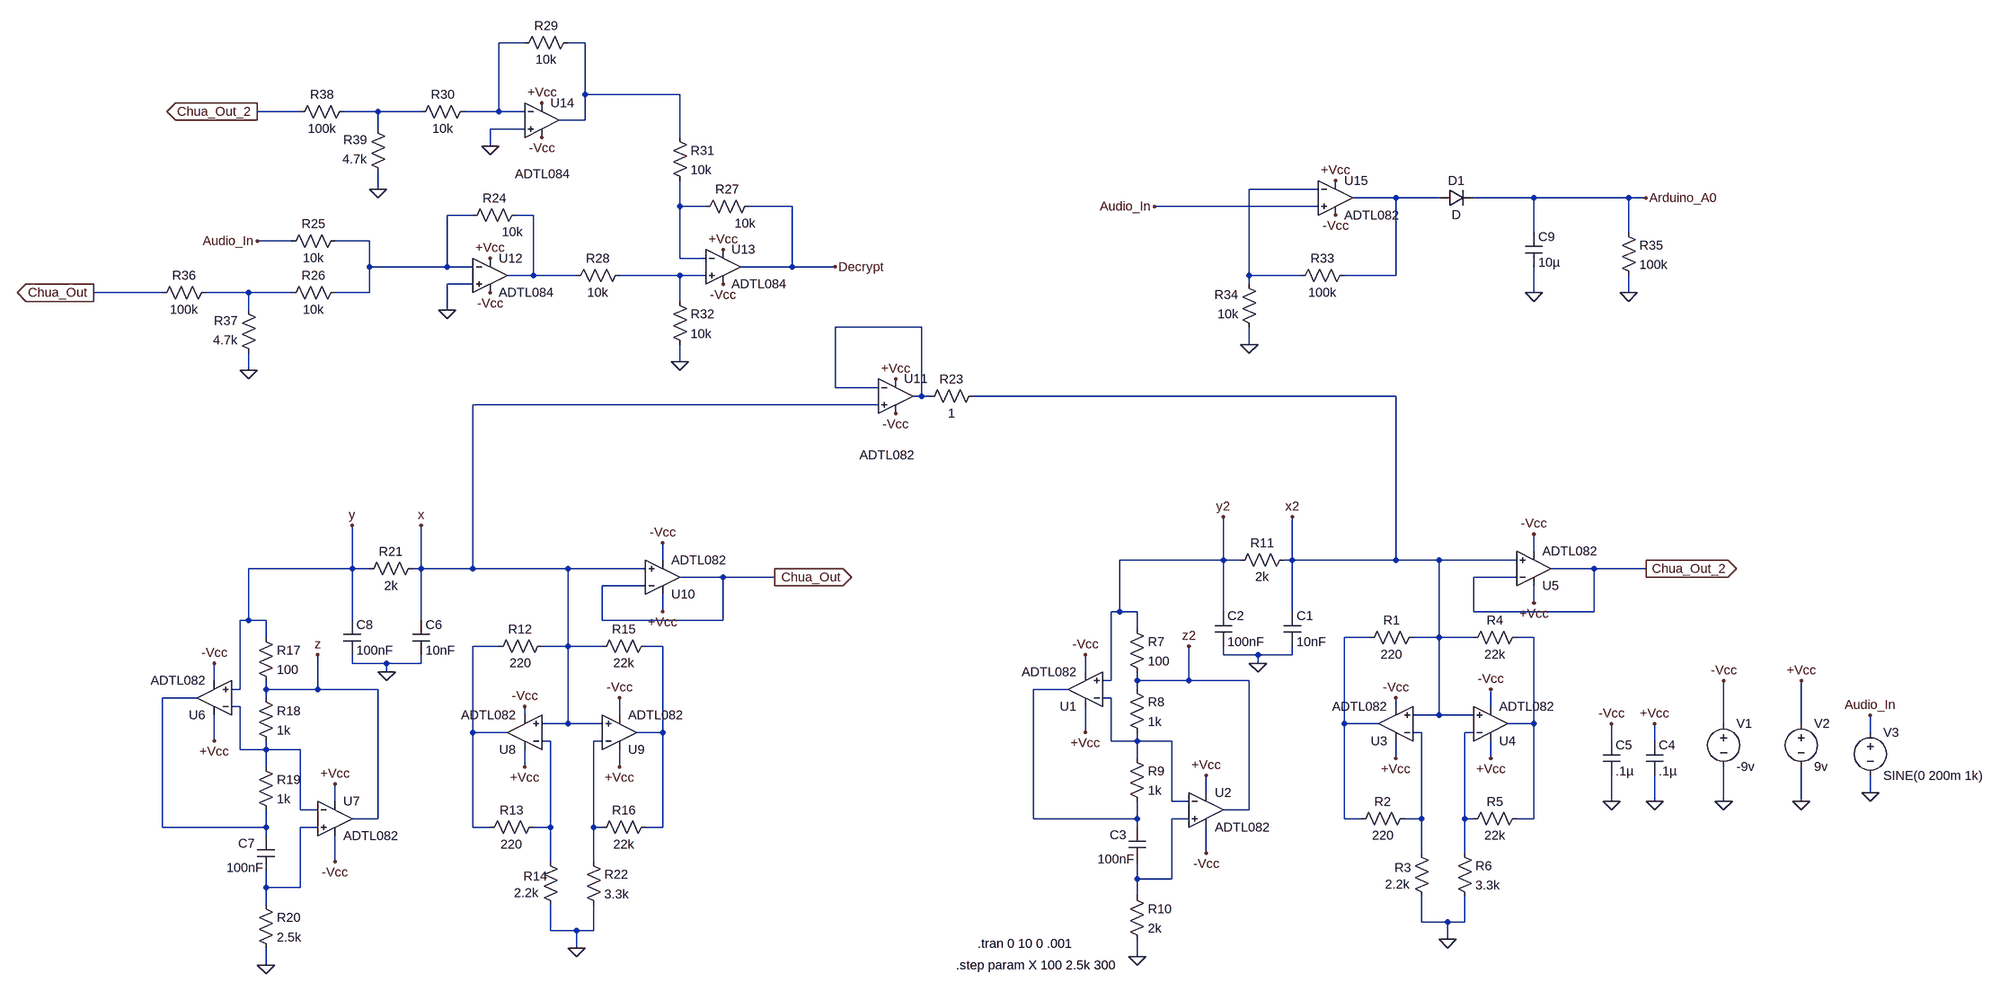
[diagram p0: schematic Chua - Copy.asc]
Chua - Copy.asc, the LTspice schematic file:
Version 4.1
SHEET 1 1768 708
WIRE -1024 -1168 -1072 -1168
WIRE -912 -1168 -944 -1168
WIRE -912 -1072 -912 -1168
WIRE -736 -1072 -912 -1072
WIRE -1440 -1040 -1520 -1040
WIRE -1296 -1040 -1360 -1040
WIRE -1216 -1040 -1296 -1040
WIRE -1072 -1040 -1072 -1168
WIRE -1072 -1040 -1136 -1040
WIRE -1024 -1040 -1072 -1040
WIRE -912 -1024 -912 -1072
WIRE -912 -1024 -960 -1024
WIRE -1296 -1008 -1296 -1040
WIRE -1024 -1008 -1088 -1008
WIRE -736 -992 -736 -1072
WIRE -1088 -976 -1088 -1008
WIRE -1296 -896 -1296 -928
WIRE 448 -896 320 -896
WIRE 592 -880 512 -880
WIRE 672 -880 592 -880
WIRE 848 -880 736 -880
WIRE 1024 -880 848 -880
WIRE 1056 -880 1024 -880
WIRE -736 -864 -736 -912
WIRE -688 -864 -736 -864
WIRE -528 -864 -608 -864
WIRE 448 -864 144 -864
WIRE -1120 -848 -1168 -848
WIRE -1008 -848 -1040 -848
WIRE 848 -816 848 -880
WIRE 1024 -816 1024 -880
WIRE -1456 -800 -1520 -800
WIRE -1312 -800 -1376 -800
WIRE -736 -768 -736 -864
WIRE -688 -768 -736 -768
WIRE -1312 -752 -1312 -800
WIRE -1168 -752 -1168 -848
WIRE -1168 -752 -1312 -752
WIRE -1120 -752 -1168 -752
WIRE -528 -752 -528 -864
WIRE -528 -752 -624 -752
WIRE -448 -752 -528 -752
WIRE -1008 -736 -1008 -848
WIRE -1008 -736 -1056 -736
WIRE -928 -736 -1008 -736
WIRE -736 -736 -848 -736
WIRE -688 -736 -736 -736
WIRE 320 -736 320 -896
WIRE 416 -736 320 -736
WIRE 592 -736 592 -880
WIRE 592 -736 496 -736
WIRE -1120 -720 -1168 -720
WIRE 320 -720 320 -736
WIRE -1696 -704 -1840 -704
WIRE -1536 -704 -1616 -704
WIRE -1456 -704 -1536 -704
WIRE -1312 -704 -1312 -752
WIRE -1312 -704 -1376 -704
WIRE 848 -704 848 -752
WIRE 1024 -704 1024 -736
WIRE -736 -688 -736 -736
WIRE -1536 -672 -1536 -704
WIRE -1168 -672 -1168 -720
WIRE -288 -640 -448 -640
WIRE 320 -608 320 -640
WIRE -736 -576 -736 -608
WIRE -1536 -560 -1536 -592
WIRE -448 -528 -448 -640
WIRE -368 -528 -448 -528
WIRE -288 -512 -288 -640
WIRE -288 -512 -304 -512
WIRE -272 -512 -288 -512
WIRE 592 -512 -192 -512
WIRE -368 -496 -1120 -496
WIRE 848 -224 848 -256
WIRE -768 -208 -768 -240
WIRE 272 -208 272 -288
WIRE 272 -208 80 -208
WIRE 304 -208 272 -208
WIRE 400 -208 400 -288
WIRE 400 -208 384 -208
WIRE 592 -208 592 -512
WIRE 592 -208 400 -208
WIRE 672 -208 592 -208
WIRE 816 -208 672 -208
WIRE -1344 -192 -1344 -272
WIRE -1344 -192 -1536 -192
WIRE -1312 -192 -1344 -192
WIRE -1216 -192 -1216 -272
WIRE -1216 -192 -1232 -192
WIRE -1120 -192 -1120 -496
WIRE -1120 -192 -1216 -192
WIRE -944 -192 -1120 -192
WIRE -800 -192 -944 -192
WIRE 960 -192 880 -192
WIRE 1056 -192 960 -192
WIRE -656 -176 -736 -176
WIRE -560 -176 -656 -176
WIRE 816 -176 736 -176
WIRE -800 -160 -880 -160
WIRE 848 -128 848 -160
WIRE -768 -112 -768 -144
WIRE 80 -112 80 -208
WIRE 80 -112 64 -112
WIRE 112 -112 80 -112
WIRE 272 -112 272 -208
WIRE 400 -112 400 -208
WIRE 736 -112 736 -176
WIRE 960 -112 960 -192
WIRE 960 -112 736 -112
WIRE -1536 -96 -1536 -192
WIRE -1536 -96 -1552 -96
WIRE -1504 -96 -1536 -96
WIRE -1344 -96 -1344 -192
WIRE -1216 -96 -1216 -192
WIRE -880 -96 -880 -160
WIRE -656 -96 -656 -176
WIRE -656 -96 -880 -96
WIRE 112 -80 112 -112
WIRE -1504 -64 -1504 -96
WIRE 544 -64 496 -64
WIRE 672 -64 672 -208
WIRE 672 -64 624 -64
WIRE 736 -64 672 -64
WIRE 848 -64 816 -64
WIRE -1072 -48 -1120 -48
WIRE -944 -48 -944 -192
WIRE -944 -48 -992 -48
WIRE -880 -48 -944 -48
WIRE -768 -48 -800 -48
WIRE 272 -32 272 -48
WIRE 336 -32 272 -32
WIRE 400 -32 400 -48
WIRE 400 -32 336 -32
WIRE -1344 -16 -1344 -32
WIRE -1280 -16 -1344 -16
WIRE -1216 -16 -1216 -32
WIRE -1216 -16 -1280 -16
WIRE 336 -16 336 -32
WIRE -1280 0 -1280 -16
WIRE 16 0 16 -32
WIRE -1600 16 -1600 -16
WIRE 64 16 64 -112
WIRE 64 16 48 16
WIRE 112 16 112 0
WIRE 208 16 208 -48
WIRE 208 16 112 16
WIRE 320 16 208 16
WIRE -1552 32 -1552 -96
WIRE -1552 32 -1568 32
WIRE -1504 32 -1504 16
WIRE -1408 32 -1408 -32
WIRE -1408 32 -1504 32
WIRE -1296 32 -1408 32
WIRE -16 32 -80 32
WIRE 112 32 112 16
WIRE -1632 48 -1696 48
WIRE -1504 48 -1504 32
WIRE 64 48 48 48
WIRE -1552 64 -1568 64
WIRE 592 64 592 48
WIRE 768 64 768 32
WIRE -1024 80 -1024 64
WIRE -848 80 -848 48
WIRE 672 80 672 -64
WIRE 672 80 624 80
WIRE 736 80 672 80
WIRE -944 96 -944 -48
WIRE -944 96 -992 96
WIRE -880 96 -944 96
WIRE 496 96 496 -64
WIRE 560 96 496 96
WIRE 848 96 848 -64
WIRE 848 96 800 96
WIRE 1200 96 1200 16
WIRE 1344 96 1344 16
WIRE -1120 112 -1120 -48
WIRE -1056 112 -1120 112
WIRE -768 112 -768 -48
WIRE -768 112 -816 112
WIRE 16 112 16 64
WIRE 640 112 624 112
WIRE 736 112 720 112
WIRE 1472 112 1472 80
WIRE -1600 128 -1600 80
WIRE -976 128 -992 128
WIRE -880 128 -896 128
WIRE 64 128 64 48
WIRE 112 128 112 112
WIRE 112 128 64 128
WIRE 176 128 112 128
WIRE 992 128 992 96
WIRE 1072 128 1072 96
WIRE -1552 144 -1552 64
WIRE -1504 144 -1504 128
WIRE -1504 144 -1552 144
WIRE -1440 144 -1504 144
WIRE 112 160 112 128
WIRE 592 160 592 128
WIRE 768 160 768 128
WIRE -1504 176 -1504 144
WIRE -1024 176 -1024 144
WIRE -848 176 -848 144
WIRE 240 224 240 192
WIRE 1472 224 1472 192
WIRE -1376 240 -1376 208
WIRE 176 240 176 128
WIRE 208 240 176 240
WIRE 992 240 992 192
WIRE 1072 240 1072 192
WIRE 1200 240 1200 176
WIRE 1344 240 1344 176
WIRE -1440 256 -1440 144
WIRE -1408 256 -1440 256
WIRE 320 256 320 16
WIRE 320 256 272 256
WIRE -1296 272 -1296 32
WIRE -1296 272 -1344 272
WIRE -80 272 -80 32
WIRE 112 272 112 240
WIRE 112 272 -80 272
WIRE 208 272 176 272
WIRE 496 272 496 96
WIRE 528 272 496 272
WIRE 640 272 640 112
WIRE 640 272 608 272
WIRE 720 272 720 112
WIRE 736 272 720 272
WIRE 848 272 848 96
WIRE 848 272 816 272
WIRE -1696 288 -1696 48
WIRE -1504 288 -1504 256
WIRE -1504 288 -1696 288
WIRE -1408 288 -1440 288
WIRE -1120 288 -1120 112
WIRE -1088 288 -1120 288
WIRE -976 288 -976 128
WIRE -976 288 -1008 288
WIRE -896 288 -896 128
WIRE -880 288 -896 288
WIRE -768 288 -768 112
WIRE -768 288 -800 288
WIRE 112 288 112 272
WIRE -1504 304 -1504 288
WIRE 240 336 240 288
WIRE 640 336 640 272
WIRE 720 336 720 272
WIRE -1376 352 -1376 304
WIRE -976 352 -976 288
WIRE -896 352 -896 288
WIRE 112 384 112 352
WIRE 176 384 176 272
WIRE 176 384 112 384
WIRE -1504 400 -1504 368
WIRE -1440 400 -1440 288
WIRE -1440 400 -1504 400
WIRE 112 416 112 384
WIRE -1504 432 -1504 400
WIRE 640 464 640 416
WIRE 688 464 640 464
WIRE 720 464 720 416
WIRE 720 464 688 464
WIRE -976 480 -976 432
WIRE -928 480 -976 480
WIRE -896 480 -896 432
WIRE -896 480 -928 480
WIRE 688 496 688 464
WIRE -928 512 -928 480
WIRE 112 528 112 496
WIRE -1504 544 -1504 512
FLAG 112 528 0
FLAG 336 -16 0
FLAG 688 496 0
FLAG 1056 -192 Chua_Out_2
IOPIN 1056 -192 Out
FLAG 1072 240 0
FLAG 1072 96 +Vcc
FLAG 1200 240 0
FLAG 1200 16 -Vcc
FLAG 992 240 0
FLAG 992 96 -Vcc
FLAG 1344 240 0
FLAG 1344 16 +Vcc
FLAG 592 160 +Vcc
FLAG 768 160 +Vcc
FLAG 848 -128 +Vcc
FLAG 16 112 +Vcc
FLAG 240 192 +Vcc
FLAG 768 32 -Vcc
FLAG 848 -256 -Vcc
FLAG 16 -32 -Vcc
FLAG 240 336 -Vcc
FLAG 592 48 -Vcc
FLAG 400 -288 x2
FLAG 272 -288 y2
FLAG 208 -48 z2
FLAG -1504 544 0
FLAG -1280 0 0
FLAG -928 512 0
FLAG -560 -176 Chua_Out
IOPIN -560 -176 Out
FLAG -1024 176 +Vcc
FLAG -848 176 +Vcc
FLAG -768 -112 +Vcc
FLAG -1600 128 +Vcc
FLAG -1376 208 +Vcc
FLAG -848 48 -Vcc
FLAG -768 -240 -Vcc
FLAG -1600 -16 -Vcc
FLAG -1376 352 -Vcc
FLAG -1024 64 -Vcc
FLAG -1216 -272 x
FLAG -1344 -272 y
FLAG -1408 -32 z
FLAG -336 -480 -Vcc
FLAG -336 -544 +Vcc
FLAG -1168 -672 0
FLAG -1088 -976 0
FLAG -736 -576 0
FLAG -448 -752 Decrypt
FLAG 1472 224 0
FLAG -1088 -704 -Vcc
FLAG -656 -720 -Vcc
FLAG -992 -992 -Vcc
FLAG -1088 -768 +Vcc
FLAG -656 -784 +Vcc
FLAG -992 -1056 +Vcc
FLAG -1520 -1040 Chua_Out_2
IOPIN -1520 -1040 Out
FLAG -1840 -704 Chua_Out
IOPIN -1840 -704 Out
FLAG 1472 80 Audio_In
FLAG -1520 -800 Audio_In
FLAG 320 -608 0
FLAG 848 -704 0
FLAG 1024 -704 0
FLAG 144 -864 Audio_In
FLAG 480 -912 +Vcc
FLAG 480 -848 -Vcc
FLAG 1056 -880 Arduino_A0
FLAG -1536 -560 0
FLAG -1296 -896 0
SYMBOL OpAmps\\ADTL082 16 96 R180
SYMATTR InstName U1
SYMBOL OpAmps\\ADTL082 240 192 R0
SYMATTR InstName U2
SYMBOL OpAmps\\ADTL082 592 160 R180
SYMATTR InstName U3
SYMBOL OpAmps\\ADTL082 768 160 M180
SYMATTR InstName U4
SYMBOL OpAmps\\ADTL082 848 -128 M180
SYMATTR InstName U5
SYMBOL res 640 -80 R90
WINDOW 0 0 56 VBottom 2
WINDOW 3 32 56 VTop 2
SYMATTR InstName R1
SYMATTR Value 220
SYMATTR SpiceLine tol=1
SYMBOL res 512 288 R270
WINDOW 0 32 56 VTop 2
WINDOW 3 0 56 VBottom 2
SYMATTR InstName R2
SYMATTR Value 220
SYMATTR SpiceLine tol=1
SYMBOL res 624 320 R0
WINDOW 0 -34 43 Left 2
WINDOW 3 -52 74 Left 2
SYMATTR InstName R3
SYMATTR Value 2.2k
SYMBOL res 832 -80 R90
WINDOW 0 0 56 VBottom 2
WINDOW 3 32 56 VTop 2
SYMATTR InstName R4
SYMATTR Value 22k
SYMATTR SpiceLine tol=1
SYMBOL res 832 256 R90
WINDOW 0 0 56 VBottom 2
WINDOW 3 32 56 VTop 2
SYMATTR InstName R5
SYMATTR Value 22k
SYMATTR SpiceLine tol=1
SYMBOL res 96 -96 R0
SYMATTR InstName R7
SYMATTR Value 100
SYMATTR SpiceLine tol=1
SYMBOL res 96 16 R0
SYMATTR InstName R8
SYMATTR Value 1k
SYMATTR SpiceLine tol=1
SYMBOL res 96 144 R0
SYMATTR InstName R9
SYMATTR Value 1k
SYMATTR SpiceLine tol=1
SYMBOL cap 384 -112 R0
SYMATTR InstName C1
SYMATTR Value 10nF
SYMBOL cap 96 288 R0
WINDOW 0 -35 14 Left 2
WINDOW 3 -57 59 Left 2
SYMATTR InstName C3
SYMATTR Value 100nF
SYMBOL res 96 400 R0
SYMATTR InstName R10
SYMATTR Value 2k
SYMATTR SpiceLine tol=1
SYMBOL res 400 -224 R90
WINDOW 0 0 56 VBottom 2
WINDOW 3 32 56 VTop 2
SYMATTR InstName R11
SYMATTR Value 2k
SYMATTR SpiceLine tol=1
SYMBOL cap 256 -112 R0
SYMATTR InstName C2
SYMATTR Value 100nF
SYMBOL cap 1056 128 R0
SYMATTR InstName C4
SYMATTR Value .1µ
SYMBOL voltage 1200 80 R0
WINDOW 123 0 0 Left 0
WINDOW 39 0 0 Left 0
SYMATTR InstName V1
SYMATTR Value -9v
SYMBOL cap 976 128 R0
SYMATTR InstName C5
SYMATTR Value .1µ
SYMBOL voltage 1344 80 R0
WINDOW 123 0 0 Left 0
WINDOW 39 0 0 Left 0
SYMATTR InstName V2
SYMATTR Value 9v
SYMBOL res 704 320 R0
SYMATTR InstName R6
SYMATTR Value 3.3k
SYMBOL OpAmps\\ADTL082 -1600 112 R180
SYMATTR InstName U6
SYMBOL OpAmps\\ADTL082 -1376 208 R0
SYMATTR InstName U7
SYMBOL OpAmps\\ADTL082 -1024 176 R180
SYMATTR InstName U8
SYMBOL OpAmps\\ADTL082 -848 176 M180
SYMATTR InstName U9
SYMBOL OpAmps\\ADTL082 -768 -112 M180
SYMATTR InstName U10
SYMBOL res -976 -64 R90
WINDOW 0 0 56 VBottom 2
WINDOW 3 32 56 VTop 2
SYMATTR InstName R12
SYMATTR Value 220
SYMATTR SpiceLine tol=1
SYMBOL res -1104 304 R270
WINDOW 0 32 56 VTop 2
WINDOW 3 0 56 VBottom 2
SYMATTR InstName R13
SYMATTR Value 220
SYMATTR SpiceLine tol=1
SYMBOL res -992 336 R0
WINDOW 0 -34 43 Left 2
WINDOW 3 -52 74 Left 2
SYMATTR InstName R14
SYMATTR Value 2.2k
SYMBOL res -784 -64 R90
WINDOW 0 0 56 VBottom 2
WINDOW 3 32 56 VTop 2
SYMATTR InstName R15
SYMATTR Value 22k
SYMATTR SpiceLine tol=1
SYMBOL res -784 272 R90
WINDOW 0 0 56 VBottom 2
WINDOW 3 32 56 VTop 2
SYMATTR InstName R16
SYMATTR Value 22k
SYMATTR SpiceLine tol=1
SYMBOL res -1520 -80 R0
SYMATTR InstName R17
SYMATTR Value 100
SYMATTR SpiceLine tol=1
SYMBOL res -1520 32 R0
SYMATTR InstName R18
SYMATTR Value 1k
SYMATTR SpiceLine tol=1
SYMBOL res -1520 160 R0
SYMATTR InstName R19
SYMATTR Value 1k
SYMATTR SpiceLine tol=1
SYMBOL cap -1232 -96 R0
SYMATTR InstName C6
SYMATTR Value 10nF
SYMBOL cap -1520 304 R0
WINDOW 0 -35 14 Left 2
WINDOW 3 -57 59 Left 2
SYMATTR InstName C7
SYMATTR Value 100nF
SYMBOL res -1520 416 R0
SYMATTR InstName R20
SYMATTR Value 2.5k
SYMATTR SpiceLine tol=1
SYMBOL res -1216 -208 R90
WINDOW 0 0 56 VBottom 2
WINDOW 3 32 56 VTop 2
SYMATTR InstName R21
SYMATTR Value 2k
SYMATTR SpiceLine tol=1
SYMBOL cap -1360 -96 R0
SYMATTR InstName C8
SYMATTR Value 100nF
SYMBOL res -912 336 R0
SYMATTR InstName R22
SYMATTR Value 3.3k
SYMBOL OpAmps\\ADTL082 -336 -576 R0
WINDOW 3 -67 173 Left 2
SYMATTR InstName U11
SYMBOL res -176 -528 R90
WINDOW 0 0 56 VBottom 2
WINDOW 3 32 56 VTop 2
SYMATTR InstName R23
SYMATTR Value 1
SYMBOL OpAmps\\ADTL084 -1088 -800 R0
SYMATTR InstName U12
SYMBOL OpAmps\\ADTL084 -656 -816 R0
SYMATTR InstName U13
SYMBOL OpAmps\\ADTL084 -992 -1088 R0
WINDOW 3 -50 164 Left 2
SYMATTR InstName U14
SYMBOL res -1024 -864 R90
WINDOW 0 0 56 VBottom 2
WINDOW 3 32 23 VTop 2
SYMATTR InstName R24
SYMATTR Value 10k
SYMBOL res -1360 -816 R90
WINDOW 0 0 56 VBottom 2
WINDOW 3 32 56 VTop 2
SYMATTR InstName R25
SYMATTR Value 10k
SYMBOL res -1360 -720 R90
WINDOW 0 0 56 VBottom 2
WINDOW 3 32 56 VTop 2
SYMATTR InstName R26
SYMATTR Value 10k
SYMBOL res -592 -880 R90
WINDOW 0 0 56 VBottom 2
WINDOW 3 32 23 VTop 2
SYMATTR InstName R27
SYMATTR Value 10k
SYMBOL res -832 -752 R90
WINDOW 0 0 56 VBottom 2
WINDOW 3 32 56 VTop 2
SYMATTR InstName R28
SYMATTR Value 10k
SYMBOL res -928 -1184 R90
WINDOW 0 0 56 VBottom 2
WINDOW 3 32 56 VTop 2
SYMATTR InstName R29
SYMATTR Value 10k
SYMBOL res -1120 -1056 R90
WINDOW 0 0 56 VBottom 2
WINDOW 3 32 56 VTop 2
SYMATTR InstName R30
SYMATTR Value 10k
SYMBOL res -752 -1008 R0
SYMATTR InstName R31
SYMATTR Value 10k
SYMBOL res -752 -704 R0
SYMATTR InstName R32
SYMATTR Value 10k
SYMBOL voltage 1472 96 R0
WINDOW 123 0 0 Left 0
WINDOW 39 0 0 Left 0
SYMATTR InstName V3
SYMATTR Value SINE(0 200m 1k)
SYMBOL OpAmps\\ADTL082 480 -944 R0
SYMATTR InstName U15
SYMBOL res 512 -752 R90
WINDOW 0 0 56 VBottom 2
WINDOW 3 32 56 VTop 2
SYMATTR InstName R33
SYMATTR Value 100k
SYMBOL res 336 -624 R180
WINDOW 0 36 76 Left 2
WINDOW 3 36 40 Left 2
SYMATTR InstName R34
SYMATTR Value 10k
SYMBOL diode 672 -864 R270
WINDOW 0 32 32 VTop 2
WINDOW 3 0 32 VBottom 2
SYMATTR InstName D1
SYMBOL cap 832 -816 R0
SYMATTR InstName C9
SYMATTR Value 10µ
SYMBOL res 1008 -832 R0
SYMATTR InstName R35
SYMATTR Value 100k
SYMBOL res -1600 -720 R90
WINDOW 0 0 56 VBottom 2
WINDOW 3 32 56 VTop 2
SYMATTR InstName R36
SYMATTR Value 100k
SYMBOL res -1520 -576 R180
WINDOW 0 36 76 Left 2
WINDOW 3 36 40 Left 2
SYMATTR InstName R37
SYMATTR Value 4.7k
SYMBOL res -1344 -1056 R90
WINDOW 0 0 56 VBottom 2
WINDOW 3 32 56 VTop 2
SYMATTR InstName R38
SYMATTR Value 100k
SYMBOL res -1280 -912 R180
WINDOW 0 36 76 Left 2
WINDOW 3 36 40 Left 2
SYMATTR InstName R39
SYMATTR Value 4.7k
TEXT -184 504 Left 2 !.tran 0 10 0 .001
TEXT -224 544 Left 2 !.step param X 100 2.5k 300

The netlist it stands for:
* Chua - Copy.asc
X§U1 y2 N018 +Vcc -Vcc N016 ADTL082  ; pins In+ In- V+ V- OUT
X§U2 N024 N018 +Vcc -Vcc z2 ADTL082  ; pins In+ In- V+ V- OUT
X§U3 x2 N020 +Vcc -Vcc N012 ADTL082  ; pins In+ In- V+ V- OUT
X§U4 x2 N021 +Vcc -Vcc N013 ADTL082  ; pins In+ In- V+ V- OUT
X§U5 x2 Chua_Out_2 +Vcc -Vcc Chua_Out_2 ADTL082  ; pins In+ In- V+ V- OUT
R1 x2 N012 220 tol=1
R2 N012 N020 220 tol=1
R3 N020 0 2.2k
R4 N013 x2 22k tol=1
R5 N013 N021 22k tol=1
R7 y2 z2 100 tol=1
R8 z2 N018 1k tol=1
R9 N018 N016 1k tol=1
C1 x2 0 10nF
C3 N016 N024 100nF
R10 N024 0 2k tol=1
R11 x2 y2 2k tol=1
C2 y2 0 100nF
C4 +Vcc 0 .1µ
V1 -Vcc 0 -9v
C5 -Vcc 0 .1µ
V2 +Vcc 0 9v
R6 N021 0 3.3k
X§U6 y N019 +Vcc -Vcc N017 ADTL082  ; pins In+ In- V+ V- OUT
X§U7 N025 N019 +Vcc -Vcc z ADTL082  ; pins In+ In- V+ V- OUT
X§U8 x N022 +Vcc -Vcc N014 ADTL082  ; pins In+ In- V+ V- OUT
X§U9 x N023 +Vcc -Vcc N015 ADTL082  ; pins In+ In- V+ V- OUT
X§U10 x Chua_Out +Vcc -Vcc Chua_Out ADTL082  ; pins In+ In- V+ V- OUT
R12 x N014 220 tol=1
R13 N014 N022 220 tol=1
R14 N022 0 2.2k
R15 N015 x 22k tol=1
R16 N015 N023 22k tol=1
R17 y z 100 tol=1
R18 z N019 1k tol=1
R19 N019 N017 1k tol=1
C6 x 0 10nF
C7 N017 N025 100nF
R20 N025 0 2.5k tol=1
R21 x y 2k tol=1
C8 y 0 100nF
R22 N023 0 3.3k
X§U11 x N011 +Vcc -Vcc N011 ADTL082  ; pins In+ In- V+ V- OUT
R23 x2 N011 1
X§U12 0 N007 +Vcc -Vcc N008 ADTL084  ; pins In+ In- V+ V- OUT
X§U13 N009 N006 +Vcc -Vcc Decrypt ADTL084  ; pins In+ In- V+ V- OUT
X§U14 0 N001 +Vcc -Vcc N002 ADTL084  ; pins In+ In- V+ V- OUT
R24 N008 N007 10k
R25 N007 Audio_In 10k
R26 N007 N010 10k
R27 Decrypt N006 10k
R28 N009 N008 10k
R29 N002 N001 10k
R30 N001 N003 10k
R31 N002 N006 10k
R32 N009 0 10k
V3 Audio_In 0 SINE(0 200m 1k)
X§U15 Audio_In N004 +Vcc -Vcc N005 ADTL082  ; pins In+ In- V+ V- OUT
R33 N005 N004 100k
R34 0 N004 10k
D1 N005 Arduino_A0 D
C9 Arduino_A0 0 10µ
R35 Arduino_A0 0 100k
R36 N010 Chua_Out 100k
R37 0 N010 4.7k
R38 N003 Chua_Out_2 100k
R39 0 N003 4.7k
.model D D
.lib standard.dio
.tran 0 10 0 .001
.step param X 100 2.5k 300
.lib ADI.lib
.lib ADTL084.lib
.backanno
.end